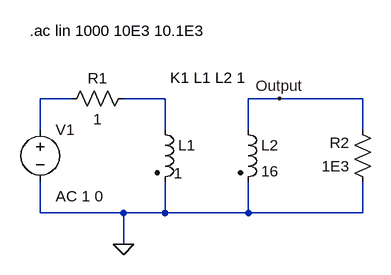
[diagram p0: schematic ideal_transformer_2.asc]
ideal_transformer_2.asc, the LTspice schematic file:
Version 4
SHEET 1 880 680
WIRE 32 336 -16 336
WIRE 176 336 112 336
WIRE 352 336 304 336
WIRE 480 336 352 336
WIRE -16 384 -16 336
WIRE 176 384 176 336
WIRE 304 384 304 336
WIRE 480 384 480 336
WIRE -16 512 -16 464
WIRE 112 512 -16 512
WIRE 176 512 176 464
WIRE 176 512 112 512
WIRE 304 512 304 464
WIRE 304 512 176 512
WIRE 480 512 480 464
WIRE 480 512 304 512
WIRE 112 560 112 512
FLAG 112 560 0
FLAG 352 336 Output
SYMBOL ind2 160 368 R0
WINDOW 3 29 83 Left 2
SYMATTR Value 1
SYMATTR InstName L1
SYMATTR Type ind
SYMBOL ind2 288 368 R0
SYMATTR InstName L2
SYMATTR Value 16
SYMATTR Type ind
SYMBOL voltage -16 368 R0
WINDOW 3 24 96 Invisible 2
WINDOW 123 24 118 Left 2
SYMATTR Value 0
SYMATTR Value2 AC 1 0
SYMATTR InstName V1
SYMBOL res 128 320 R90
WINDOW 0 0 56 VBottom 2
WINDOW 3 32 56 VTop 2
SYMATTR InstName R1
SYMATTR Value 1
SYMBOL res 496 480 R180
WINDOW 0 36 76 Left 2
WINDOW 3 36 40 Left 2
SYMATTR InstName R2
SYMATTR Value 1E3
TEXT 184 304 Left 2 !K1 L1 L2 1
TEXT -32 232 Left 2 !.ac lin 1000 10E3 10.1E3

The netlist it stands for:
* ideal_transformer_2.asc
L1 N002 0 1
L2 Output 0 16
V1 N001 0 0 AC 1 0
R1 N002 N001 1
R2 0 Output 1E3
K1 L1 L2 1
.ac lin 1000 10E3 10.1E3
.backanno
.end